# EAGLE design contacto (EAGLE 9.1.3)
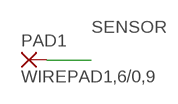
[diagram p0: schematic, sheet 1]

## Parts
PAD1  WIREPAD1,6/0,9  [1,6/0,9]

## Nets
SENSOR: PAD1.1(P)

## Library data of the parts
PAD1 = wirepad:WIREPAD: Wire PAD connect wire on PCB

## Board
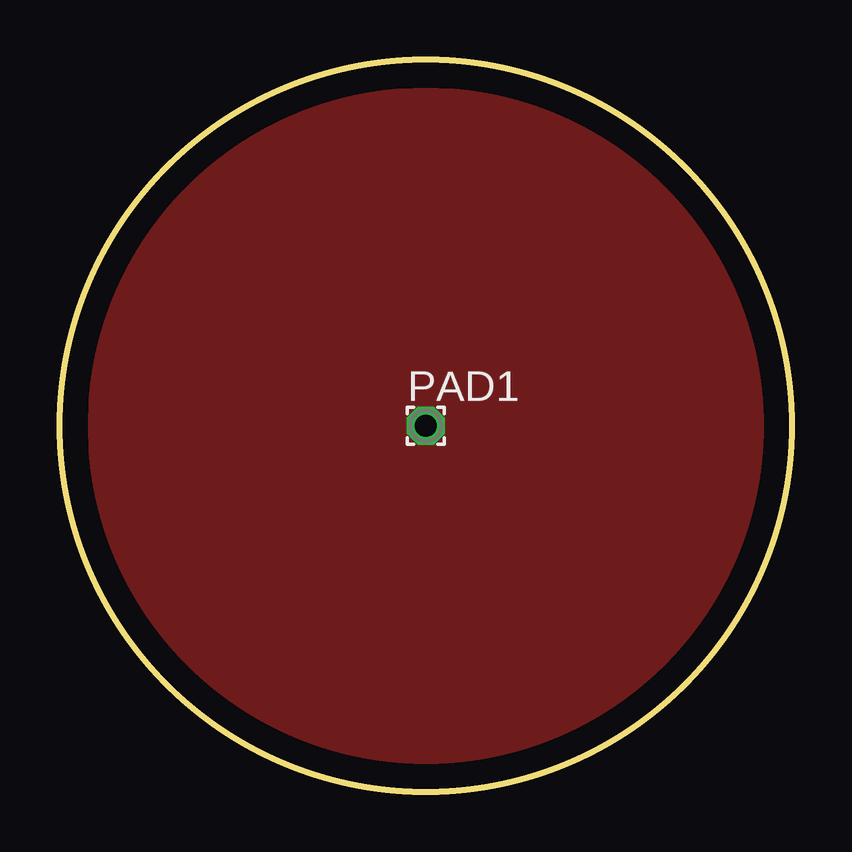
[diagram p1: board, top side]
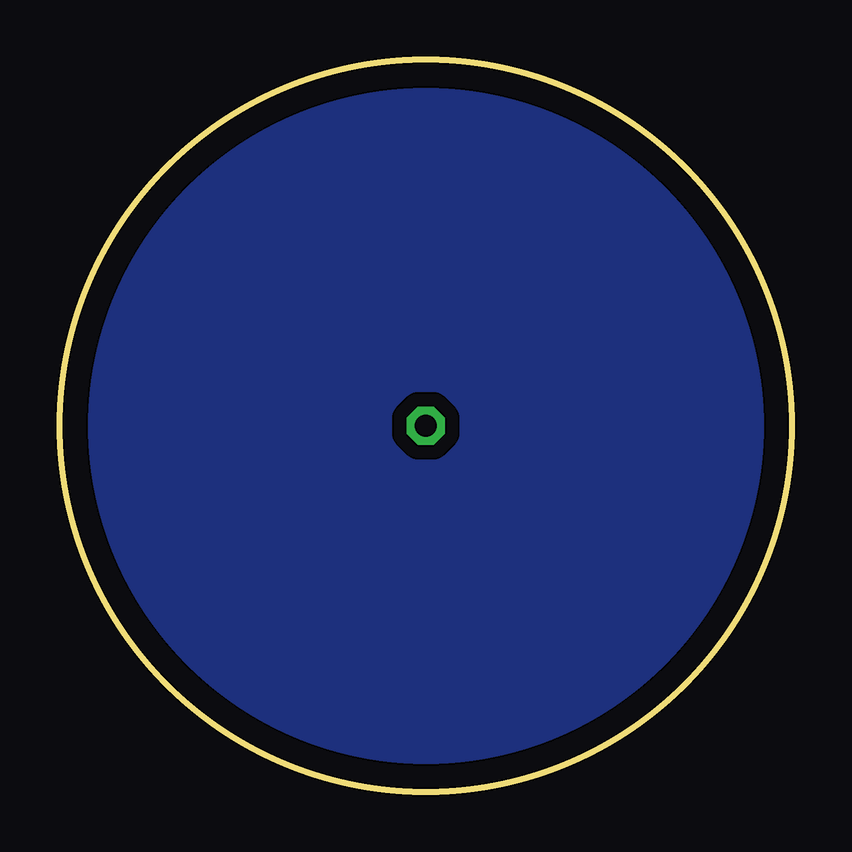
[diagram p2: board, bottom side, seen from below]

Size 30.48 x 30.48 mm. Coordinates in mm from the lower left corner, seen from the top.
Outline: circle at 15.24,15.24 radius 15.24
Copper layers (1*16): Top 0.035mm / dielectric 1.5mm / Bottom 0.035mm
Design rules "default": minimum track width 6mil, minimum drill 0.35mm, track to track 6mil, track to pad 6mil, pad to pad 6mil, via to via 6mil, smd to smd 6mil, copper to edge 40mil, drill to drill 6mil, minimum pad ring 10mil, minimum via ring 8mil, stop-mask expansion 4mil, vias tented up to drill 0mil, thermal gap 10mil

### Footprints (pad centres in the part's own frame; a part is rotated, then mirrored left to right if it is on the bottom)
1,6/0,9 = drill 0.914 pad 1.6 octagon: 1 0,0

### Placement (x,y rotation side)
PAD1  15.24,15.24 0 top

### Tracks (layer width: path | path; a pad name or v marks a point on that pad's centre or on a via)
BLIND
  pour Top (isolate 0.406): 18.01,30.03 11.61,29.6 arc34 6.63,27.69 arc37 0.51,18.44 arc57 3.53,5.71 arc105 28.5,7.65 arc29 30.13,12.51 arc78
GND
  pour Bottom (isolate 0.61): 15.98,30.33 14.33,30.28 arc82 0.2,17.32 arc102 16.94,0.28 arc92 30.25,17.04 arc79 16,30.33
SENSOR
  pour Top (isolate 0.406): 14.43,30.5 12.04,30.04 arc78 0.21,15.86 arc40 3.82,5.45 arc121 29.22,9.69 arc111